# Altium project UKU202045.PRJPCB
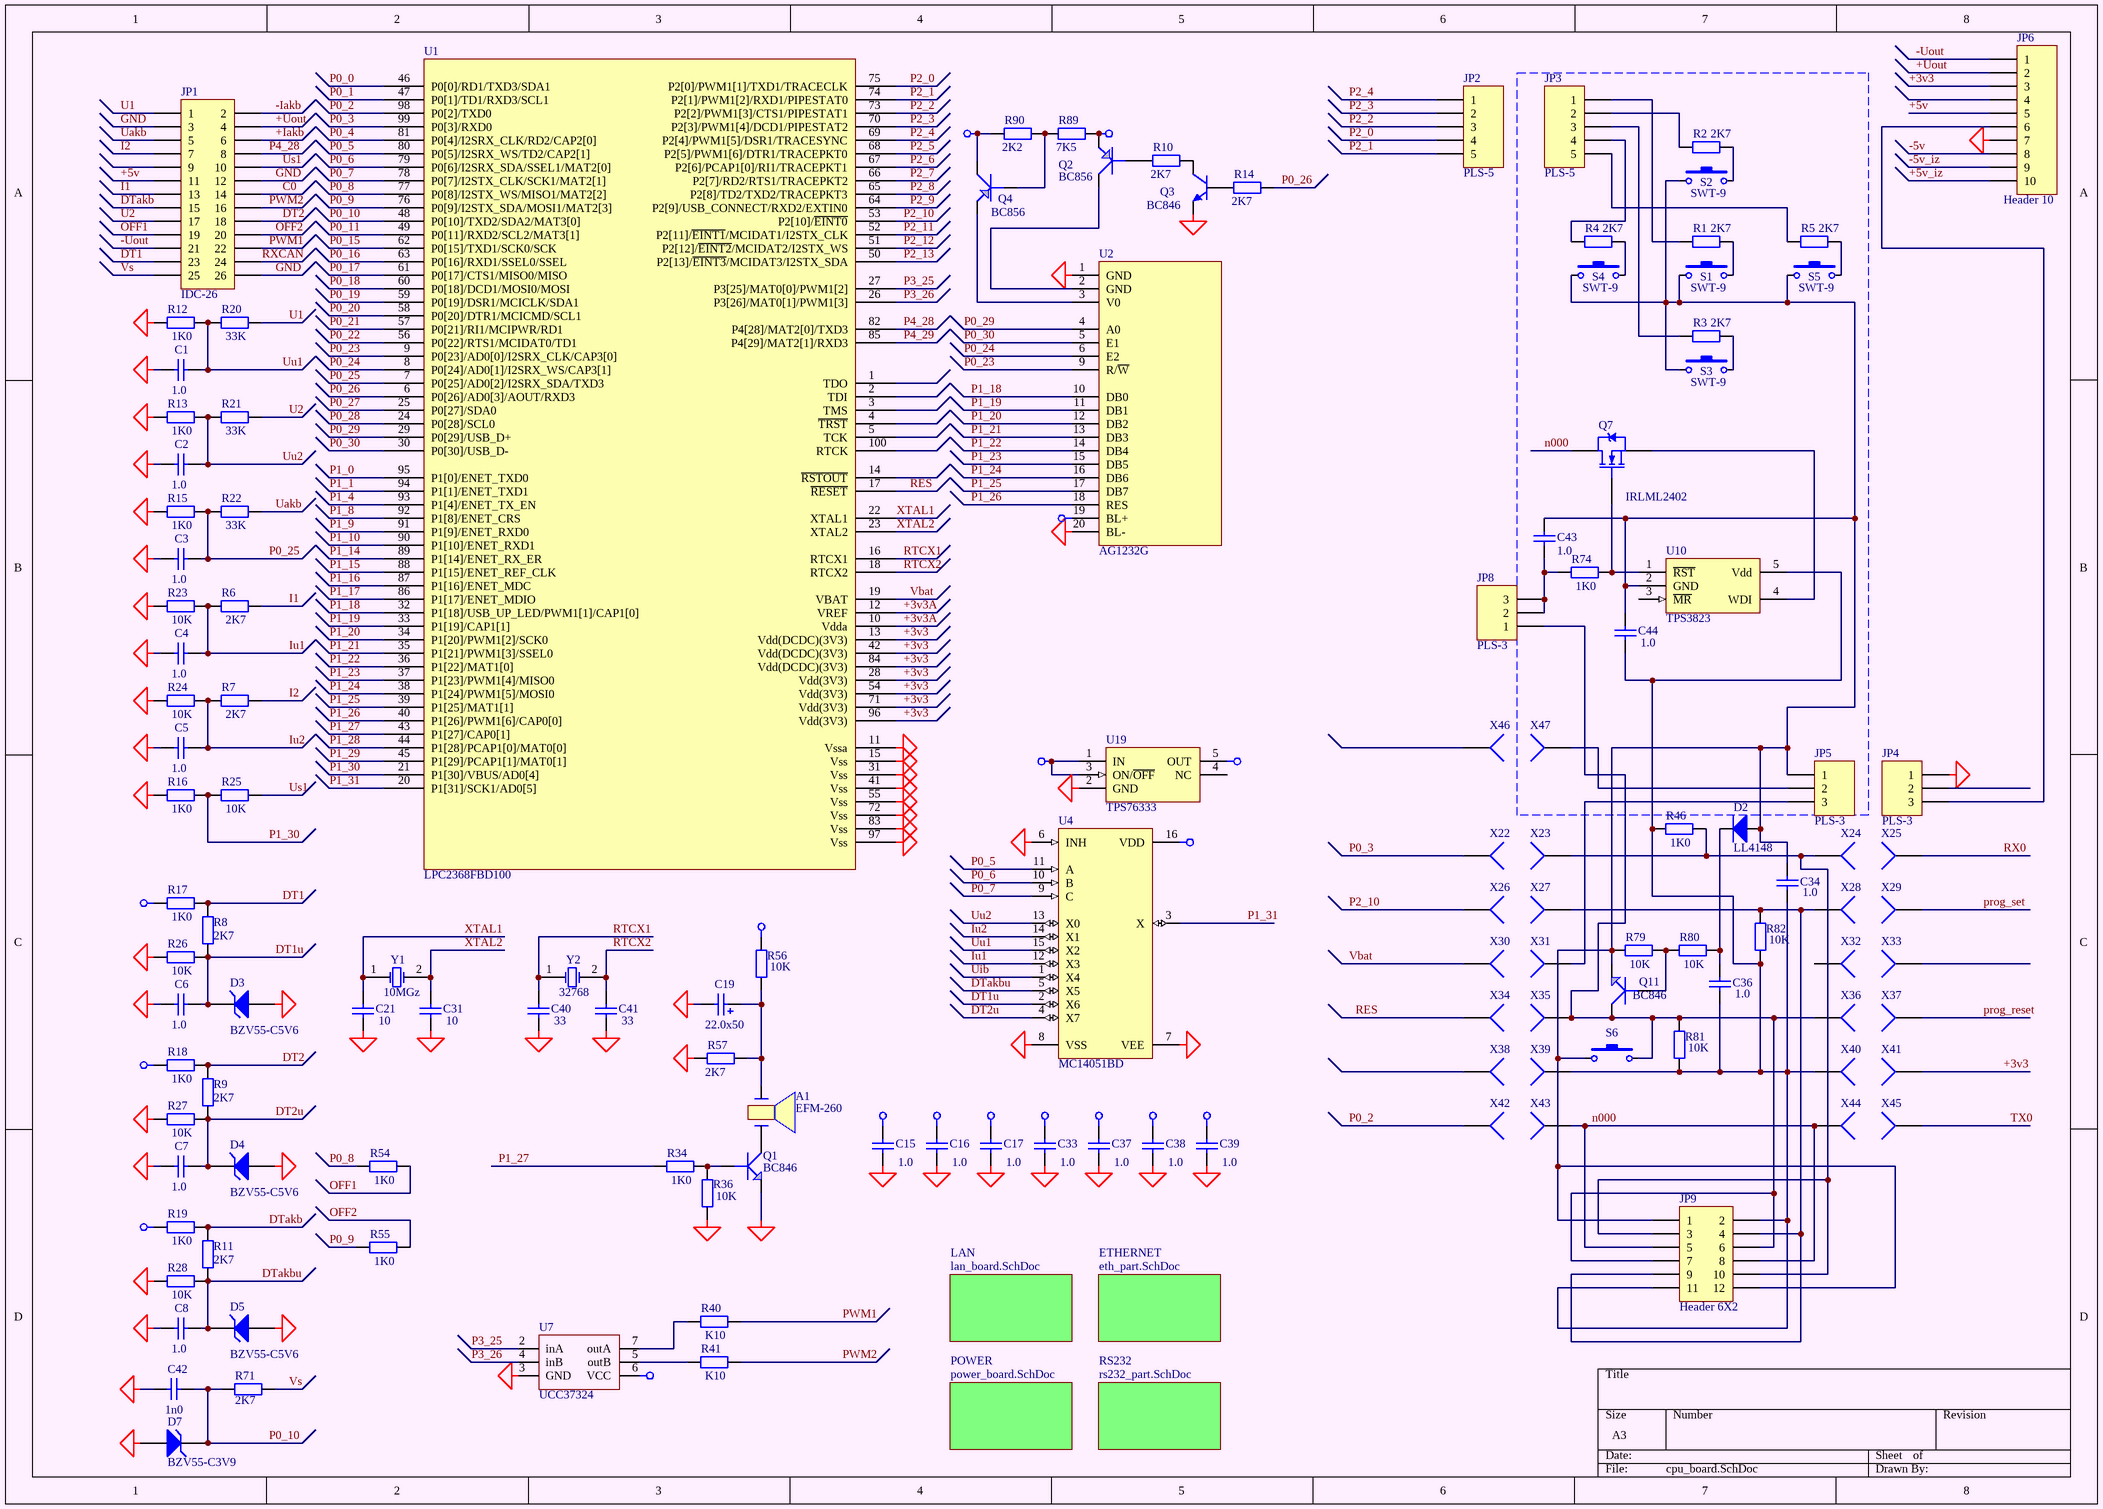
[diagram p0: cpu_board.SchDoc]
5 sheets, 290 parts. Net scope: global (net labels, ports and power ports of the same name join across sheets).
Board file: UKU202045.PcbDoc
Sheets:
  cpu_board.SchDoc
    POWER = power_board.SchDoc
    RS232 = rs232_part.SchDoc
    LAN = lan_board.SchDoc
    ETHERNET = eth_part.SchDoc

## Sheet cpu_board.SchDoc
size A3

### Parts
A1  EFM-260  [Pjezo15]
C1  1.0  [C3216-1206]
C2  1.0  [C3216-1206]
C3  1.0  [C3216-1206]
C4  1.0  [C3216-1206]
C5  1.0  [C3216-1206]
C6  1.0  [C3216-1206]
C7  1.0  [C3216-1206]
C8  1.0  [_1206]
C15  1.0  [C3216-1206]
C16  1.0  [C3216-1206]
C17  1.0  [_1206]
C19  22.0x50  [el3]
C21  10  [_1206]
C31  10  [_1206]
C33  1.0  [_1206]
C34  1.0  [C3216-1206]
C36  1.0  [C3216-1206]
C37  1.0  [_1206]
C38  1.0  [_1206]
C39  1.0  [_1206]
C40  33  [_1206]
C41  33  [_1206]
C42  1n0  [_1206]
C43  1.0  [_1206]
C44  1.0  [_1206]
D2  LL4148  [_1206d]
D3  BZV55-C5V6  [_1206d]
D4  BZV55-C5V6  [_1206d]
D5  BZV55-C5V6  [_1206d]
D7  BZV55-C3V9  [_1206d]
JP1  IDC-26  [SCM-26]
JP2  PLS-5  [HDR1X5]
JP3  PLS-5  [HDR1X5]
JP4  PLS-3  [HDR1X3]
JP5  PLS-3  [HDR1X3]
JP6  Header 10  [HDR2X5]
JP8  PLS-3  [HDR1X3]
JP9  Header 6X2  [sl-12mini]
Q1  BC846  [SO-G3]
Q2  BC856  [SO-G3]
Q3  BC846  [SO-G3]
Q4  BC856  [SO-G3]
Q7  IRLML2402  [SO-G3]
Q11  BC846  [SO-G3]
R1  2K7  [_1206]
R2  2K7  [_1206]
R3  2K7  [_1206]
R4  2K7  [_1206]
R5  2K7  [_1206]
R6  2K7  [_1206]
R7  2K7  [_1206]
R8  2K7  [_1206]
R9  2K7  [_1206]
R10  2K7  [_1206]
R11  2K7  [_1206]
R12  1K0  [_1206]
R13  1K0  [_1206]
R14  2K7  [_1206]
R15  1K0  [_1206]
R16  1K0  [_1206]
R17  1K0  [_1206]
R18  1K0  [_1206]
R19  1K0  [_1206]
R20  33K  [_1206]
R21  33K  [_1206]
R22  33K  [_1206]
R23  10K  [_1206]
R24  10K  [_1206]
R25  10K  [_1206]
R26  10K  [_1206]
R27  10K  [_1206]
R28  10K  [_1206]
R34  1K0  [_1206]
R36  10K  [_1206]
R40  K10  [_1206]
R41  K10  [_1206]
R46  1K0  [_1206]
R54  1K0  [_1206]
R55  1K0  [_1206]
R56  10K  [_1206]
R57  2K7  [_1206]
R71  2K7  [_1206]
R74  1K0  [_1206]
R79  10K  [_1206]
R80  10K  [_1206]
R81  10K  [_1206]
R82  10K  [_1206]
R89  7K5  [_1206]
R90  2K2  [_1206]
S1  SWT-9  [SWT-9]
S2  SWT-9  [SWT-9]
S3  SWT-9  [SWT-9]
S4  SWT-9  [SWT-9]
S5  SWT-9  [SWT-9]
S6  SWT-6  [SWT-6]  (value not drawn)
U1  LPC2368FBD100  [LPC2368]
U2  AG1232G  [AG1232G]
U4  MC14051BD  [SO-G16/C5.85]
U7  UCC37324  [SO-G8]
U10  TPS3823  [SO-G5/P.95]
U19  TPS76333  [SO-G5/P.95]
X22  (no value)  [PIN1]
X23  (no value)  [PIN1]
X24  (no value)  [PIN1]
X25  (no value)  [PIN1]
X26  (no value)  [PIN1]
X27  (no value)  [PIN1]
X28  (no value)  [PIN1]
X29  (no value)  [PIN1]
X30  (no value)  [PIN1]
X31  (no value)  [PIN1]
X32  (no value)  [PIN1]
X33  (no value)  [PIN1]
X34  (no value)  [PIN1]
X35  (no value)  [PIN1]
X36  (no value)  [PIN1]
X37  (no value)  [PIN1]
X38  (no value)  [PIN1]
X39  (no value)  [PIN1]
X40  (no value)  [PIN1]
X41  (no value)  [PIN1]
X42  (no value)  [PIN1]
X43  (no value)  [PIN1]
X44  (no value)  [PIN1]
X45  (no value)  [PIN1]
X46  (no value)  [PIN1]
X47  (no value)  [PIN1]
Y1  10MGz  [QWARZ1]
Y2  32768  [QWARZ2]

### Sub-sheets
ETHERNET = eth_part.SchDoc: no entries
LAN = lan_board.SchDoc: no entries
POWER = power_board.SchDoc: no entries
RS232 = rs232_part.SchDoc: no entries

### Nets
+3v3: C37.2 C38.2 C39.2 JP6.3 U1.13(Vdd(DCDC)(3V3)) U1.28(Vdd(3V3)) U1.42(Vdd(DCDC)(3V3)) U1.54(Vdd(3V3)) U1.71(Vdd(3V3)) U1.84(Vdd(DCDC)(3V3)) U1.96(Vdd(3V3)) U4.16(VDD) X41.1
+3v3A: C17.2 C33.2 U1.10(Vdda) U1.12(VREF) U19.5(OUT)
+5v: C15.2 JP1.11 JP6.5 Q2.2(E) R17.2 R18.2 R19.2 R89.2 U2.19(BL+) U7.6(VCC) U19.1(IN) U19.3(ON/~{OFF})
+5v_iz: JP6.10
+Uout: JP1.4 JP6.2 R56.2
-5v: C16.2 JP6.8 Q4.3(C) R90.1
-5v_iz: JP6.9
GND: C1.2 C2.2 C3.2 C4.2 C5.2 C6.2 C7.2 C8.2 C15.1 C16.1 C17.1 C19.2 C21.1 C31.1 C33.1 C37.1 C38.1 C39.1 C40.1 C41.1 C42.2 D3.1(A) D4.1(A) D5.1(A) D7.1(A) JP1.3 JP1.12 JP1.26 JP4.1 JP6.7 Q1.2(E) Q3.2(E) R12.2 R13.2 R15.2 R16.2 R23.1 R24.1 R26.1 R27.1 R28.1 R36.1 R57.1 U1.11(Vssa) U1.15(Vss) U1.31(Vss) U1.41(Vss) U1.55(Vss) U1.72(Vss) U1.83(Vss) U1.97(Vss) U2.1(GND) U2.20(BL-) U4.6(INH) U4.7(VEE) U4.8(VSS) U7.3(GND) U19.2(GND)
+Iakb: JP1.6
-Iakb: JP1.2
-Uout: JP1.21 JP6.1
C0: JP1.14
DT1: JP1.23 R8.2 R17.1
DT1u: C6.1 D3.2(K) R8.1 R26.2 U4.2(X6)
DT2: JP1.18 R9.2 R18.1
DT2u: C7.1 D4.2(K) R9.1 R27.2 U4.4(X7)
DTakb: JP1.15 R11.2 R19.1
DTakbu: C8.1 D5.2(K) R11.1 R28.2 U4.5(X5)
I1: JP1.13 R6.2
I2: JP1.7 R7.2
Iu1: C4.1 R6.1 R23.2 U4.12(X3)
Iu2: C5.1 R7.1 R24.2 U4.14(X1)
n000: JP9.5 JP9.8 Q7.3(D) X43.1 X44.1
OFF1: JP1.19 R54.2
OFF2: JP1.20 R55.2
P0_0: U1.46(P0[0]/RD1/TXD3/SDA1)
P0_1: U1.47(P0[1]/TD1/RXD3/SCL1)
P0_2: U1.98(P0[2]/TXD0) X42.1
P0_3: U1.99(P0[3]/RXD0) X22.1
P0_4: U1.81(P0[4]/I2SRX_CLK/RD2/CAP2[0])
P0_5: U1.80(P0[5]/I2SRX_WS/TD2/CAP2[1]) U4.11(A)
P0_6: U1.79(P0[6]/I2SRX_SDA/SSEL1/MAT2[0]) U4.10(B)
P0_7: U1.78(P0[7]/I2STX_CLK/SCK1/MAT2[1]) U4.9(C)
P0_8: R54.1 U1.77(P0[8]/I2STX_WS/MISO1/MAT2[2])
P0_9: R55.1 U1.76(P0[9]/I2STX_SDA/MOSI1/MAT2[3])
P0_10: C42.1 D7.2(K) R71.2 U1.48(P0[10]/TXD2/SDA2/MAT3[0])
P0_11: U1.49(P0[11]/RXD2/SCL2/MAT3[1])
P0_15: U1.62(P0[15]/TXD1/SCK0/SCK)
P0_16: U1.63(P0[16]/RXD1/SSEL0/SSEL)
P0_17: U1.61(P0[17]/CTS1/MISO0/MISO)
P0_18: U1.60(P0[18]/DCD1/MOSI0/MOSI)
P0_19: U1.59(P0[19]/DSR1/MCICLK/SDA1)
P0_20: U1.58(P0[20]/DTR1/MCICMD/SCL1)
P0_21: U1.57(P0[21]/RI1/MCIPWR/RD1)
P0_22: U1.56(P0[22]/RTS1/MCIDAT0/TD1)
P0_23: U1.9(P0[23]/AD0[0]/I2SRX_CLK/CAP3[0]) U2.9(R/~{W})
P0_24: U1.8(P0[24]/AD0[1]/I2SRX_WS/CAP3[1]) U2.6(E2)
P0_25: C3.1 R15.1 R22.1 U1.7(P0[25]/AD0[2]/I2SRX_SDA/TXD3)
P0_26: R14.1 U1.6(P0[26]/AD0[3]/AOUT/RXD3)
P0_27: U1.25(P0[27]/SDA0)
P0_28: U1.24(P0[28]/SCL0)
P0_29: U1.29(P0[29]/USB_D+) U2.4(A0)
P0_30: U1.30(P0[30]/USB_D-) U2.5(E1)
P1_0: U1.95(P1[0]/ENET_TXD0)
P1_1: U1.94(P1[1]/ENET_TXD1)
P1_4: U1.93(P1[4]/ENET_TX_EN)
P1_8: U1.92(P1[8]/ENET_CRS)
P1_9: U1.91(P1[9]/ENET_RXD0)
P1_10: U1.90(P1[10]/ENET_RXD1)
P1_14: U1.89(P1[14]/ENET_RX_ER)
P1_15: U1.88(P1[15]/ENET_REF_CLK)
P1_16: U1.87(P1[16]/ENET_MDC)
P1_17: U1.86(P1[17]/ENET_MDIO)
P1_18: U1.32(P1[18]/USB_UP_LED/PWM1[1]/CAP1[0]) U2.10(DB0)
P1_19: U1.33(P1[19]/CAP1[1]) U2.11(DB1)
P1_20: U1.34(P1[20]/PWM1[2]/SCK0) U2.12(DB2)
P1_21: U1.35(P1[21]/PWM1[3]/SSEL0) U2.13(DB3)
P1_22: U1.36(P1[22]/MAT1[0]) U2.14(DB4)
P1_23: U1.37(P1[23]/PWM1[4]/MISO0) U2.15(DB5)
P1_24: U1.38(P1[24]/PWM1[5]/MOSI0) U2.16(DB6)
P1_25: U1.39(P1[25]/MAT1[1]) U2.17(DB7)
P1_26: U1.40(P1[26]/PWM1[6]/CAP0[0]) U2.18(RES)
P1_27: R34.1 U1.43(P1[27]/CAP0[1])
P1_28: U1.44(P1[28]/PCAP1[0]/MAT0[0])
P1_29: U1.45(P1[29]/PCAP1[1]/MAT0[1])
P1_30: R16.1 R25.1 U1.21(P1[30]/VBUS/AD0[4])
P1_31: U1.20(P1[31]/SCK1/AD0[5]) U4.3(X)
P2_0: JP2.4 U1.75(P2[0]/PWM1[1]/TXD1/TRACECLK)
P2_1: JP2.5 U1.74(P2[1]/PWM1[2]/RXD1/PIPESTAT0)
P2_2: JP2.3 U1.73(P2[2]/PWM1[3]/CTS1/PIPESTAT1)
P2_3: JP2.2 U1.70(P2[3]/PWM1[4]/DCD1/PIPESTAT2)
P2_4: JP2.1 U1.69(P2[4]/PWM1[5]/DSR1/TRACESYNC)
P2_5: U1.68(P2[5]/PWM1[6]/DTR1/TRACEPKT0)
P2_6: U1.67(P2[6]/PCAP1[0]/RI1/TRACEPKT1)
P2_7: U1.66(P2[7]/RD2/RTS1/TRACEPKT2)
P2_8: U1.65(P2[8]/TD2/TXD2/TRACEPKT3)
P2_9: U1.64(P2[9]/USB_CONNECT/RXD2/EXTIN0)
P2_10: U1.53(P2[10]/~{EINT0}) X26.1
P2_11: U1.52(P2[11]/~{EINT1}/MCIDAT1/I2STX_CLK)
P2_12: U1.51(P2[12]/~{EINT2}/MCIDAT2/I2STX_WS)
P2_13: U1.50(P2[13]/~{EINT3}/MCIDAT3/I2STX_SDA)
P3_25: U1.27(P3[25]/MAT0[0]/PWM1[2]) U7.2(inA)
P3_26: U1.26(P3[26]/MAT0[1]/PWM1[3]) U7.4(inB)
P4_28: JP1.8 U1.82(P4[28]/MAT2[0]/TXD3)
P4_29: U1.85(P4[29]/MAT2[1]/RXD3)
prog_reset: X37.1
prog_set: X29.1
PWM1: JP1.22 R40.1
PWM2: JP1.16 R41.1
RES: U1.17(~{RESET}) X34.1
RTCX1: C40.2 U1.16(RTCX1) Y2.1(OSC1)
RTCX2: C41.2 U1.18(RTCX2) Y2.2(OSC2)
RX0: X25.1
RXCAN: JP1.24
TX0: X45.1
U1: JP1.1 R20.2
U2: JP1.17 R21.2
Uakb: JP1.5 R22.2
Uib: U4.1(X4)
Us1: JP1.10 R25.2
Uu1: C1.1 R12.1 R20.1 U4.15(X2)
Uu2: C2.1 R13.1 R21.1 U4.13(X0)
Vbat: U1.19(VBAT) X30.1
Vs: JP1.25 R71.1
XTAL1: C21.2 U1.22(XTAL1) Y1.1(OSC1)
XTAL2: C31.2 U1.23(XTAL2) Y1.2(OSC2)
NetA1_1: A1.1 Q1.3(C)
NetA1_2: A1.2 C19.1 R56.1 R57.2
NetC34_1: C34.1 C43.1 C44.2 D2.1(A) JP5.1 JP9.1 JP9.12 Q11.2(E) R79.1 S1.1 S2.1 S3.1 S4.1 S5.1 S6.1 U10.2(GND)
NetC34_2: C34.2 C36.2 C44.1 JP9.2 JP9.11 R46.2 R81.1 R82.1 U10.5(Vdd) X39.1 X40.1
NetC36_1: C36.1 D2.2(K) R80.2
NetC43_2: C43.2 JP8.2 JP8.3 R74.2
NetJP3_1: JP3.1 R1.2
NetJP3_2: JP3.2 R2.2
NetJP3_3: JP3.3 R3.2
NetJP3_4: JP3.4 R4.2
NetJP3_5: JP3.5 R5.2
NetJP4_3: JP4.3 JP6.6
NetJP5_2: JP5.2 X47.1
NetJP5_3: JP5.3 X31.1
NetJP8_1: JP8.1 JP9.6 JP9.7 Q11.3(C) R81.2 S6.2 X35.1 X36.1
NetJP9_3: JP9.3 JP9.10 R46.1 X23.1 X24.1
NetJP9_4: JP9.4 JP9.9 R82.2 X27.1 X28.1
NetQ1_1: Q1.1(B) R34.2 R36.2
NetQ2_1: Q2.1(B) R10.2
NetQ2_3: Q2.3(C) U2.2(GND)
NetQ3_1: Q3.1(B) R14.2
NetQ3_3: Q3.3(C) R10.1
NetQ4_1: Q4.1(B) R89.1 R90.2
NetQ4_2: Q4.2(E) U2.3(V0)
NetQ7_1: Q7.1(G) R74.1 U10.1(~{RST})
NetQ7_2: Q7.2(S) U10.4(WDI)
NetQ11_1: Q11.1(B) R79.2 R80.1
NetR1_1: R1.1 S1.2
NetR2_1: R2.1 S2.2
NetR3_1: R3.1 S3.2
NetR4_1: R4.1 S4.2
NetR5_1: R5.1 S5.2
NetR40_2: R40.2 U7.7(outA)
NetR41_2: R41.2 U7.5(outB)

Not connected (* = marked no-connect by the designer): JP1 9; JP4 2; JP6 4; U1 1(TDO) 2(TDI) 3(TMS) 4(~{TRST}) 5(TCK) 14(~{RSTOUT}) 100(RTCK); U10 3(~{MR}); U19 4(NC); X32 1; X33 1; X38 1; X46 1

### Library data of the parts
A1 = PJEZ0
C1-C8 C34 C36 C42 = Cap Semi: Capacitor (Semiconductor SIM Model); Manufacturer: Generic Components; Class I: Passive; Value: 1,0; Published: 8-Jun-2000; Revision: July-2002: Re-released for DXP Platform.; Publisher: Altium Limited; Class II: Capacitor
C15-C17 C33 C37-C39 = Cap Semi: Capacitor (Semiconductor SIM Model); Manufacturer: Generic Components; Class I: Passive; Value: 0,1; Published: 8-Jun-2000; Revision: July-2002: Re-released for DXP Platform.; Publisher: Altium Limited; Class II: Capacitor
C19 = Cap Pol1: Polarized Capacitor (Radial); Manufacturer: Generic Components; Class I: Passive; Value: 22,0; Published: 8-Jun-2000; Revision: July-2002: Re-released for DXP Platform.; Publisher: Altium Limited; Class II: Capacitor
C21 C31 C40 C41 = Cap Semi: Capacitor (Semiconductor SIM Model); Manufacturer: Generic Components; Class I: Passive; Value: 15pF; Published: 8-Jun-2000; Revision: July-2002: Re-released for DXP Platform.; Publisher: Altium Limited; Class II: Capacitor
C43 C44 = Cap Semi: Capacitor; Manufacturer: Generic Components; Class I: Passive; Value: 0,1; Published: 8-Jun-2000; Revision: July-2002: Re-released for DXP Platform.; Publisher: Altium Limited; Class II: Capacitor
D2 = Diode: Default Diode; Manufacturer: Generic Components; Class I: Discrete; Class II: Diode - Switching; Published: 8-Jun-2000; Revision: July-2002: Re-released for DXP Platform.; Publisher: Altium Limited
D3-D5 D7 = D Zener: Zener Diode; Manufacturer: Generic Components; Class I: Discrete; Class II: Diode - Zener; Published: 8-Jun-2000; Revision: July-2002: Re-released for DXP Platform.; Publisher: Altium Limited
JP1 = MHDR2X13: Header, 13-Pin, Dual row; Manufacturer: Generic Components; Class I: Connector; Revision: July-2002: Re-released for DXP Platform.; Publisher: Altium Limited
JP2 JP3 = Header 5: Header, 5-Pin; Manufacturer: Generic Components; Class I: Connector; Revision: July-2002: Re-released for DXP Platform.; Publisher: Altium Limited
JP4 JP5 JP8 = Header 3: Header, 3-Pin; Manufacturer: Generic Components; Class I: Connector; Revision: July-2002: Re-released for DXP Platform.; Publisher: Altium Limited
JP6 = Header 10: Header, 10-Pin; Manufacturer: Generic Components; Class I: Connector; Revision: July-2002: Re-released for DXP Platform.; Publisher: Altium Limited
JP9 = Header 6X2: Header, 6-Pin, Dual row; Manufacturer: Generic Components; Class I: Connector; Revision: July-2002: Re-released for DXP Platform.; Publisher: Altium Limited
Q1 Q11 = GT122: Right: 20; Bottom: 20
Q2 Q4 = GT109: Right: 20; Bottom: 20
Q3 = BC847ALT1: General Purpose Transistor NPN Silicon; Manufacturer: Motorola; Package Information: Latest Revision: 1997; Class I: Discrete; Class II: BJT - Low Power; Published: 29-Sep-2000; Revision: July-2002: Re-released for DXP Platform.; Datasheet: Latest Revision: 1997; Package Reference: 318-08; Publisher: Altium Limited
Q7 = IRLML2402: HEXFET Power MOSFET; Manufacturer: International Rectifier; Class I: Discrete; Class II: MOSFET - Power; Published: 8-Jun-2000; Revision: July-2002: Re-released for DXP Platform.; Datasheet: Latest Revision: Aug-1997; Package Reference: SOT-23; Publisher: Altium Limited; Value: IRLML2402
R1-R9 R11 R20-R28 R34 R40 R41 R46 R54-R57 R71 R74 R79-R82 R89 R90 = Res2: Resistor; Manufacturer: Generic Components; Class I: Passive; Rule: Undefined; Published: 8-Jun-2000; Revision: July-2002: Re-released for DXP Platform.; Publisher: Altium Limited; Class II: Resistor
  R1-R9 R11 R57 R71: Value: 2K7
  R20-R22: Value: 33K
  R23-R28 R56 R79-R82: Value: 10K
  R34 R46 R54 R55 R74: Value: 1K0
  R40 R41: Value: K10
  R89: Value: 7K5
  R90: Value: 2K2
R10 R14 = Res2: Resistor; Manufacturer: Generic Components; Class I: Passive; Value: 1K0; Rule: Undefined; Published: 8-Jun-2000; Revision: July-2002: Re-released for DXP Platform.; Publisher: Altium Limited; Class II: Resistor
R12 R13 R15-R19 = Res2: Resistor; Manufacturer: Generic Components; Class I: Passive; Value: 1K; Rule: Undefined; Published: 8-Jun-2000; Revision: July-2002: Re-released for DXP Platform.; Publisher: Altium Limited; Class II: Resistor
R36 = Res2: Resistor; Manufacturer: Generic Components; Class I: Passive; Published: 8-Jun-2000; Revision: July-2002: Re-released for DXP Platform.; Publisher: Altium Limited; Class II: Resistor; Value: 10K
S1-S5 = SWT-9: Switch; Manufacturer: Generic Components; Published: 24-Mar-1999; Revision: July-2002: Re-released for DXP Platform.; Publisher: Altium Limited
S6 = SWT-9: Button; Manufacturer: Generic Components; Published: 24-Mar-1999; Revision: July-2002: Re-released for DXP Platform.; Publisher: Altium Limited; Value: SWT-6
U4 = MC14051BD: 8-Channel Analog Multiplexer/Demultiplexer; Manufacturer: ON Semiconductor; Class I: Logic; Class II: Multiplexer/Encoder/Selector; Published: 15-Apr-2002; Package Reference: 751B-05; Publisher: Altium Limited
U10 = TPS3823: Reset IC; Manufacturer: National Semiconductor; Package Information: Latest Revision: Aug-1999; Class I: Power Management; Class II: Voltage Regulator; Value: TPS76333; Published: 15-Apr-2002; Datasheet: Latest Revision: Oct-1999; Package Reference: MA05B; Publisher: Altium Limited
U19 = LP2980AIM5-3.3: Micropower SOT, 50 mA Ultra Low-Dropout Regulator; Manufacturer: National Semiconductor; Package Information: Latest Revision: Aug-1999; Class I: Power Management; Class II: Voltage Regulator; Published: 15-Apr-2002; Datasheet: Latest Revision: Oct-1999; Package Reference: MA05B; Publisher: Altium Limited
X22-X47 = Socket: Manufacturer: Generic Components; Class I: Connector; Revision: July-2002: Re-released for DXP Platform.; Publisher: Altium Limited
Y1 Y2 = XTAL: Crystal Oscillator; Manufacturer: Generic Components; Published: 8-Jun-2000; Revision: July-2002: Re-released for DXP Platform.; Publisher: Altium Limited; Class I: Oscillator; Class II: Crystal Oscillator

## Sheet power_board.SchDoc
size A3
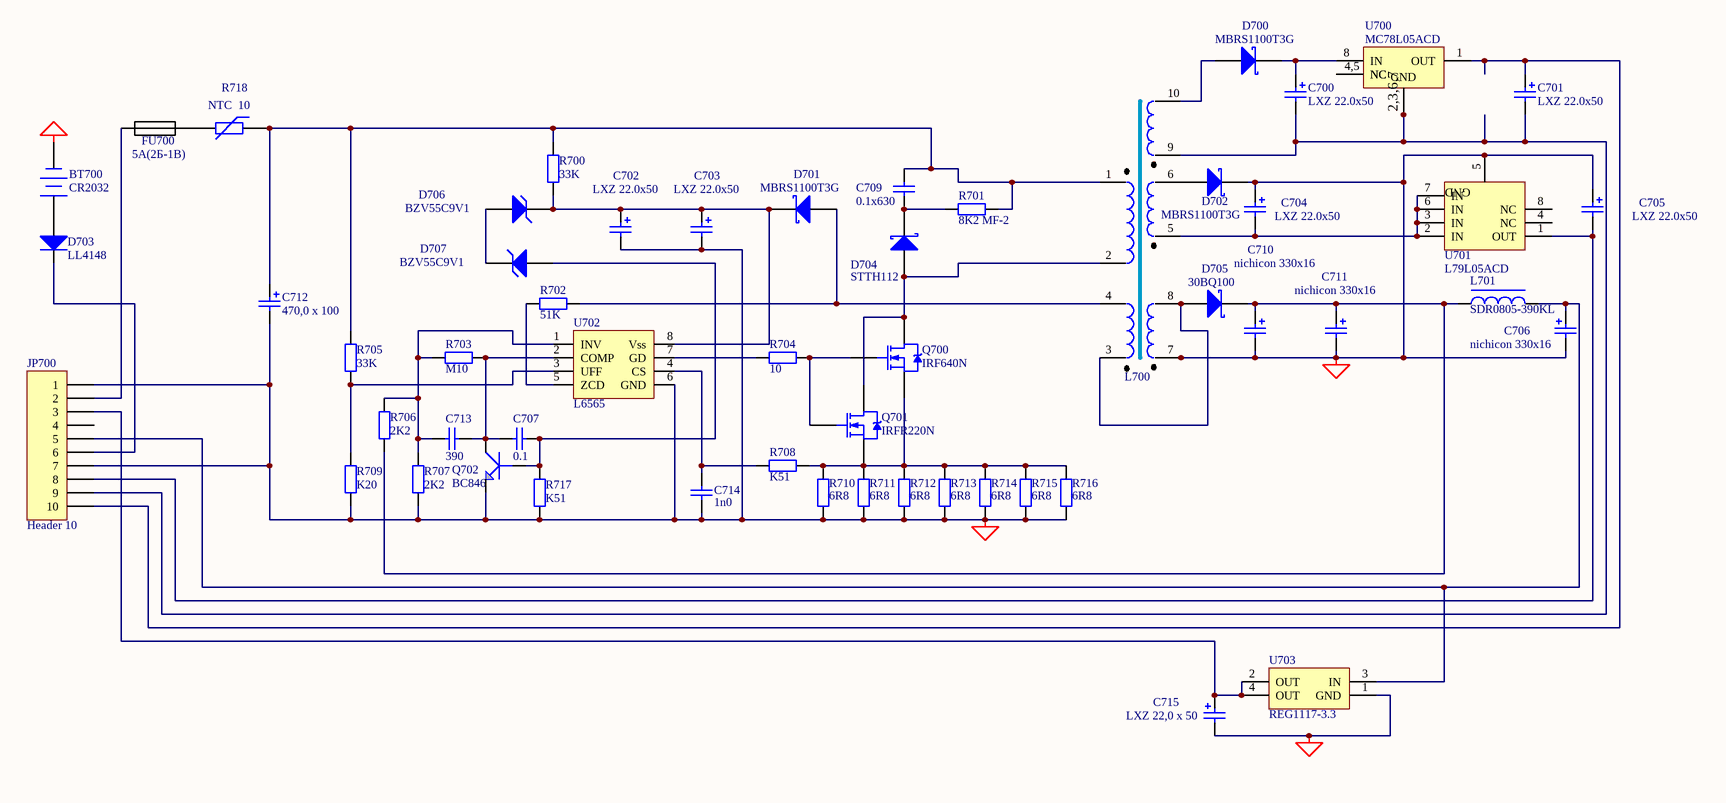
[diagram p1: power_board.SchDoc]

### Parts
BT700  CR2032  [BAT_SUPP]
C700  LXZ 22.0x50  [el3]
C701  LXZ 22.0x50  [el3]
C702  LXZ 22.0x50  [el3]
C703  LXZ 22.0x50  [el3]
C704  LXZ 22.0x50  [el3]
C705  LXZ 22.0x50  [el3]
C706  nichicon 330x16  [el5]
C707  0.1  [_1206]
C709  0.1x630  [c15]
C710  nichicon 330x16  [el5]
C711  nichicon 330x16  [el5]
C712  470,0 x 100  [el_15_25_h]
C713  390  [_1206]
C714  1n0  [_1206]
C715  LXZ 22,0 x 50  [el3]
D700  MBRS1100T3G  [D_6_3]
D701  MBRS1100T3G  [D_6_3]
D702  MBRS1100T3G  [D_6_3]
D703  LL4148  [_1206d]
D704  STTH112  [D_6_3]
D705  30BQ100  [30BQ100]
D706  BZV55C9V1  [_1206d]
D707  BZV55C9V1  [_1206d]
FU700  5A(2Б-1В)  [FUSE2]
JP700  Header 10  [HDR2X5]
L700  L220-K10  [trans_ring1]  (value not drawn)
L701  SDR0805-390KL  [L10x10]
Q700  IRF640N  [TO220_h]
Q701  IRFR220N  [SIP-G3/E13]
Q702  BC846  [SO-G3]
R700  33K  [_1206]
R701  8K2 MF-2  [AXIAL-0.7]
R702  51K  [_1206]
R703  M10  [_1206]
R704  10  [_1206]
R705  33K  [_1206]
R706  2K2  [_1206]
R707  2K2  [_1206]
R708  K51  [_1206]
R709  K20  [_1206]
R710  6R8  [_1206]
R711  6R8  [_1206]
R712  6R8  [_1206]
R713  6R8  [_1206]
R714  6R8  [_1206]
R715  6R8  [_1206]
R716  6R8  [_1206]
R717  K51  [_1206]
R718  NTC  10  [JVR07N]
U700  MC78L05ACD  [SO-G8]
U701  L79L05ACD  [SO-G8]
U702  L6565  [so-g8]
U703  REG1117-3.3  [DSO-G3]

### Nets
GND_p: BT700.2(-) C702.2 C703.2 C704.1 C705.1 C706.2 C710.2 C711.2 C712.2 C714.2 C715.2 D702.2(K) JP700.1 JP700.7 L700.7 Q702.2(E) R707.1 R709.1 R710.2 R711.2 R712.2 R713.2 R714.2 R715.2 R716.2 R717.1 U701.5(GND) U702.6(GND) U703.1(GND)
NetBT700_1: BT700.1(+) D703.1(A)
NetC700_1: C700.1 D700.2(K) U700.8(IN)
NetC700_2: C700.2 C701.2 JP700.9 L700.9 U700.2(GND) U700.3(GND) U700.6(GND) U700.7(GND)
NetC701_1: C701.1 JP700.10 U700.1(OUT)
NetC702_1: C702.1 C703.1 D701.2(K) D706.2(K) R700.2 U702.8(Vss)
NetC704_2: C704.2 L700.5 U701.2(IN) U701.3(IN) U701.6(IN) U701.7(IN)
NetC705_2: C705.2 JP700.8 U701.1(OUT)
NetC706_1: C706.1 JP700.5 L701.1 U703.3(IN)
NetC707_1: C707.1 C713.2 Q702.3(C) R703.1 U702.2(COMP)
NetC707_2: C707.2 D707.1(A) Q702.1(B) R717.2
NetC709_1: C709.1 D704.2(K) R701.2
NetC709_2: C709.2 C712.1 L700.1 R700.1 R701.1 R705.2 R718.1
NetC710_1: C710.1 C711.1 D705.2(K) L701.2 R706.1
NetC713_1: C713.1 R703.2 R706.2 R707.2 U702.1(INV)
NetC714_1: C714.1 R708.2 U702.4(CS)
NetC715_1: C715.1 JP700.3 U703.2(OUT) U703.4(OUT)
NetD700_1: D700.1(A) L700.10
NetD701_1: D701.1(A) L700.4 R702.1
NetD702_1: D702.1(A) L700.6
NetD703_2: D703.2(K) JP700.6
NetD704_1: D704.1(A) L700.2 Q700.2(D) Q701.2(D)
NetD705_1: D705.1(A) L700.3 L700.8
NetD706_1: D706.1(A) D707.2(K)
NetFU700_1: FU700.1 JP700.2
NetFU700_2: FU700.2 R718.2
NetQ700_1: Q700.1(G) Q701.1(G) R704.1
NetQ700_3: Q700.3(S) Q701.3(S) R708.1 R710.1 R711.1 R712.1 R713.1 R714.1 R715.1 R716.1
NetR702_2: R702.2 U702.5(ZCD)
NetR704_2: R704.2 U702.7(GD)
NetR705_1: R705.1 R709.2 U702.3(UFF)
NetU700_4: U700.4(NC) U700.5(NC)

Not connected (* = marked no-connect by the designer): JP700 4; U701 4(NC) 8(NC)

### Notes on the sheet
- (in symbol MC78L05ACD) 4,5; 2,3,6,7

### Library data of the parts
BT700 = Battery: Multicell Battery; Manufacturer: Generic Components; Published: 24-Mar-1999; Revision: July-2002: Re-released for DXP Platform.; Publisher: Altium Limited
C700 C701 = Cap Pol1: Polarized Capacitor (Radial); Manufacturer: Generic Components; Class I: Passive; Value: 10,0x25; Published: 8-Jun-2000; Revision: July-2002: Re-released for DXP Platform.; Publisher: Altium Limited; Class II: Capacitor
C702-C706 C710-C712 = Cap Pol1: Polarized Capacitor (Radial); Manufacturer: Generic Components; Class I: Passive; Value: 22,0x50; Published: 8-Jun-2000; Revision: July-2002: Re-released for DXP Platform.; Publisher: Altium Limited; Class II: Capacitor
C707 C709 C713 C714 = Cap Semi: as C1 on sheet cpu_board; Published: 8-Jun-2000; Revision: July-2002: Re-released for DXP Platform.; Publisher: Altium Limited; Class II: Capacitor
C715 = Cap Pol1: Polarized Capacitor (Radial); Manufacturer: Generic Components; Class I: Passive; Published: 8-Jun-2000; Revision: July-2002: Re-released for DXP Platform.; Publisher: Altium Limited; Class II: Capacitor; Value: 22,0x50
D700-D702 D705 = 10BQ015: Schottky Rectifier; Manufacturer: International Rectifier; Revision 1: 10-July-2000: SIM Model Added.; Revision 2: July-2002: Re-released for DXP Platform.; Class I: Discrete; Class II: Rectifier - Schottky; Published: 8-Jun-2000; Datasheet: Latest Revision: PD-2.396A; Package Reference: DO-214AA; Publisher: Altium Limited
D703 = Diode: as D2 on sheet cpu_board; Published: 8-Jun-2000; Revision: July-2002: Re-released for DXP Platform.; Publisher: Altium Limited
D704 = 10BQ015: Schottky Diode; Manufacturer: International Rectifier; Revision 1: 10-July-2000: SIM Model Added.; Revision 2: July-2002: Re-released for DXP Platform.; Class I: Discrete; Class II: Rectifier - Schottky; Value: 10BQ100; Published: 8-Jun-2000; Datasheet: Latest Revision: PD-2.396A; Package Reference: DO-214AA; Publisher: Altium Limited
D706 D707 = D Zener: Zener Diode; Manufacturer: Generic Components; Class I: Discrete; Class II: Diode - Zener; Value: BZV55C3V9; Published: 8-Jun-2000; Revision: July-2002: Re-released for DXP Platform.; Publisher: Altium Limited
FU700 = FUSE
JP700 = Header 10: as JP6 on sheet cpu_board; Revision: July-2002: Re-released for DXP Platform.; Publisher: Altium Limited
L700 = L1_dc_2: Дроссель
L701 = Inductor Konstr 2: Magnetic-Core Inductor; Manufacturer: Generic Components; Class I: Passive; Published: 24-Mar-1999; Revision: July-2002: Re-released for DXP Platform.; Publisher: Altium Limited; Class II: Inductor
Q700 Q701 = NMOS-2: N-Channel Power MOSFET; Manufacturer: Generic Components; Class I: Discrete; Class II: MOSFET - Power; Note: Pin 2 is electrically connected to pin 4.; Published: 8-Jun-2000; Revision: July-2002: Re-released for DXP Platform.; Datasheet: Latest Revision: PD-9.814; Package Reference: TO-220AB; Publisher: Altium Limited
Q702 = GT122: Bipolar transistor; Right: 20; Bottom: 20; Value: BC846
R700-R717 = Res2: as R10 on sheet cpu_board; Published: 8-Jun-2000; Revision: July-2002: Re-released for DXP Platform.; Publisher: Altium Limited; Class II: Resistor
R718 = Res Varistor: Varistor (Voltage-Sensitive Resistor); Manufacturer: Generic Components; Class I: Discrete; Published: 24-Mar-1999; Revision: July-2002: Re-released for DXP Platform.; Publisher: Altium Limited; Class II: Voltage-Sensitive Resistor
U700 = MC78L05ACD: 3-Terminal Low-Current Positive Fixed Voltage Regulator; Manufacturer: Motorola; Class I: Power Management; Published: 15-Apr-2002; Datasheet: Linear and Interface Integrated Circuits, DL128 Rev2 (1988); Package Reference: 751-02; Publisher: Altium Limited; Class II: Voltage Regulator
U701 = L79L05ACD: Negative Voltage Regulator; Manufacturer: ST-Microelectronics; Package Information: Latest Revision: Jul-1998; Class I: Power Management; Published: 24-Aug-2001; Revision: July-2002: Re-released for DXP Platform.; Datasheet: Latest Revision: Apr-1999; Package Reference: SO8; Publisher: Altium Limited; Class II: Voltage Regulator
U703 = REG1117-3.3: 800mA and 1A Low Dropout Positive Regulator 2.85V, 3.3V, 5V, and Adjustable; Manufacturer: Burr-Brown; Package Information: Latest Revision: Rev. C; Class I: Power Management; Class II: Voltage Regulator; Published: 8-Jun-2000; Revision: July-2002: Re-released for DXP Platform.; Datasheet: Latest Revision: Sep-1997; Package Reference: ZZ311; Publisher: Altium Limited

## Sheet rs232_part.SchDoc
size B
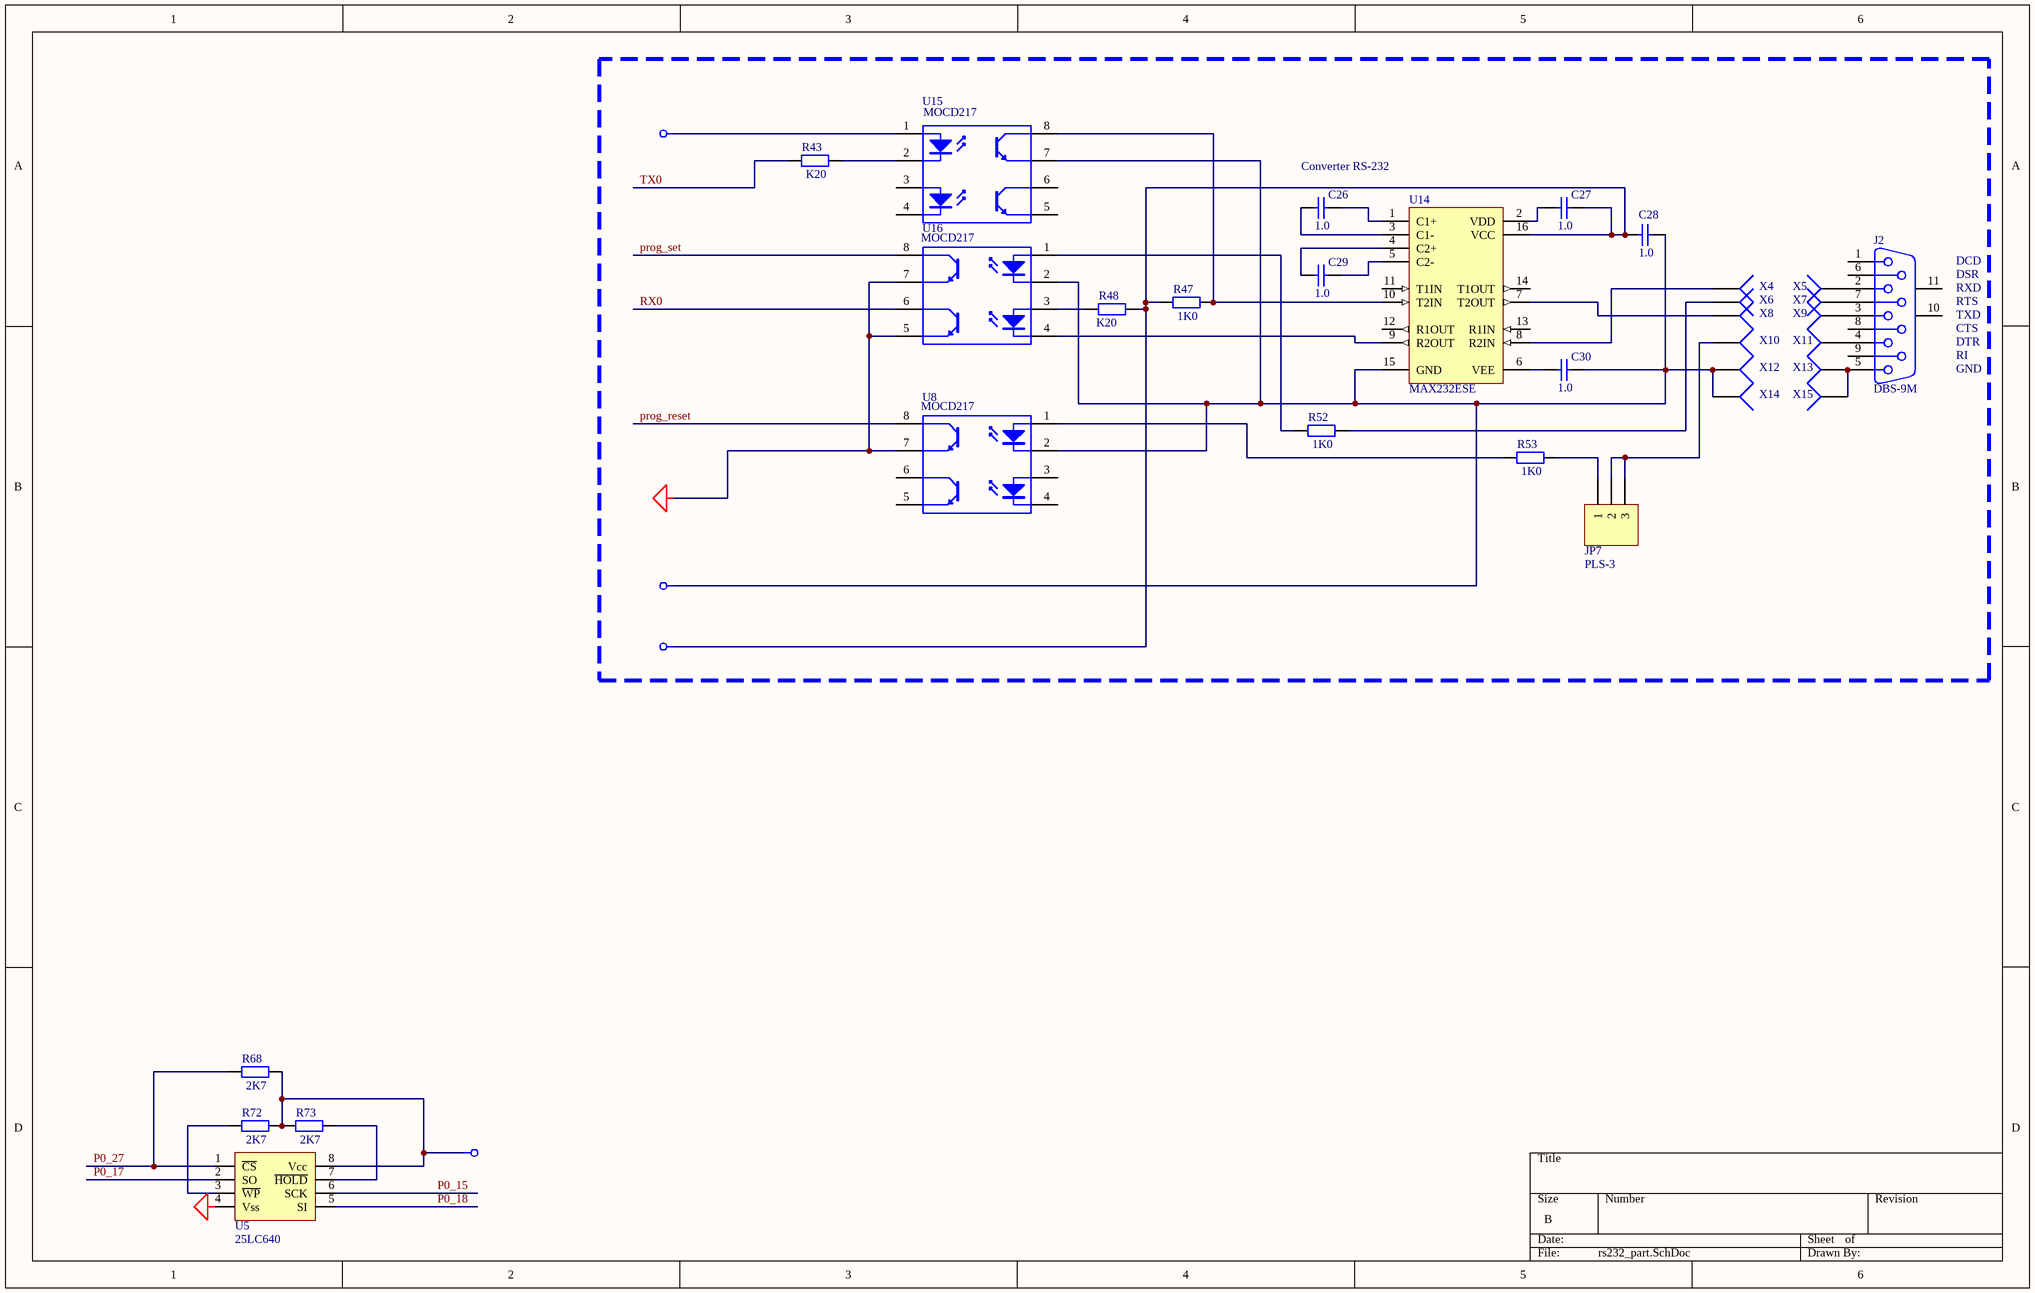
[diagram p2: rs232_part.SchDoc]

### Parts
C26  1.0  [C3216-1206]
C27  1.0  [_1206]
C28  1.0  [C3216-1206]
C29  1.0  [C3216-1206]
C30  1.0  [C3216-1206]
J2  DBS-9M  [DSUB_N9]
JP7  PLS-3  [HDR1X3]
R43  K20  [_1206]
R47  1K0  [_1206]
R48  K20  [_1206]
R52  1K0  [_1206]
R53  1K0  [_1206]
R68  2K7  [_1206]
R72  2K7  [_1206]
R73  2K7  [_1206]
U5  25LC640  [SO-G8/D5]
U8  MOCD217  [SO-G8]
U14  MAX232ESE  [SO-G16]
U15  MOCD217  [SO-G8]
U16  MOCD217  [SO-G8]
X4  (no value)  [PIN1]
X5  (no value)  [PIN1]
X6  (no value)  [PIN1]
X7  (no value)  [PIN1]
X8  (no value)  [PIN1]
X9  (no value)  [PIN1]
X10  (no value)  [PIN1]
X11  (no value)  [PIN1]
X12  (no value)  [PIN1]
X13  (no value)  [PIN1]
X14  (no value)  [PIN1]
X15  (no value)  [PIN1]

### Nets
+3v3: U15.1(A)
+5v: R68.2 R72.2 R73.1 U5.8(Vcc)
+5v_iz: C27.2 C28.1 R47.1 R48.2 U14.16(VCC)
-5v_iz: C28.2 C30.2 U8.2(K) U14.15(GND) U15.7(E) U16.2(K) X12.1 X14.1
GND: U5.4(Vss) U8.7(E) U16.5(E) U16.7(E)
P0_15: U5.6(SCK)
P0_17: U5.2(SO)
P0_18: U5.5(SI)
P0_27: R68.1 U5.1(~{CS})
prog_reset: U8.8(C)
prog_set: U16.8(C)
RX0: U16.6(C)
TX0: R43.1
NetC26_1: C26.1 U14.3(C1-)
NetC26_2: C26.2 U14.1(C1+)
NetC27_1: C27.1 U14.2(VDD)
NetC29_1: C29.1 U14.4(C2+)
NetC29_2: C29.2 U14.5(C2-)
NetC30_1: C30.1 U14.6(VEE)
NetJ2_2: J2.2 X5.1
NetJ2_3: J2.3 X9.1
NetJ2_4: J2.4 X11.1
NetJ2_5: J2.5 X13.1 X15.1
NetJ2_7: J2.7 X7.1
NetJP7_1: JP7.1 R53.2
NetJP7_2: JP7.2 JP7.3 X10.1
NetR43_2: R43.2 U15.2(K)
NetR47_2: R47.2 U14.10(T2IN) U15.8(C)
NetR48_1: R48.1 U16.3(A)
NetR52_1: R52.1 U16.1(A)
NetR52_2: R52.2 X6.1
NetR53_1: R53.1 U8.1(A)
NetR72_1: R72.1 U5.3(~{WP})
NetR73_2: R73.2 U5.7(~{HOLD})
NetU14_7: U14.7(T2OUT) X8.1
NetU14_8: U14.8(R2IN) X4.1
NetU14_9: U14.9(R2OUT) U16.4(K)

Not connected (* = marked no-connect by the designer): J2 1 6 8 9 10(MH1) 11(MH2); U8 3(A) 4(K) 5(E) 6(C); U14 11(T1IN) 12(R1OUT) 13(R1IN) 14(T1OUT); U15 3(A) 4(K) 5(E) 6(C)

### Notes on the sheet
- Converter RS-232
- (near J2) DCD
- (near J2) DSR
- (near J2) RXD
- (near J2) RTS
- (near J2) TXD
- (near J2) CTS
- (near J2) DTR
- (near J2) RI
- (near J2) GND

### Library data of the parts
C26-C30 = Cap Semi: as C1 on sheet cpu_board; Published: 8-Jun-2000; Revision: July-2002: Re-released for DXP Platform.; Publisher: Altium Limited; Class II: Capacitor
J2 = D Connector 9: Receptacle Assembly, 9 Position, Right Angle; Manufacturer: Generic Components; Package Information: Latest Revision: O; Positions: 9; Published: 15-Jun-2001; Revision: July-2002: Re-released for DXP Platform.; Datasheet: (1-Sep-1999); Package Reference: 788750; Publisher: Altium Limited; Class I: Connector; Orientation: Right Angle; Gender: Receptacle
JP7 = Header 3: as JP4 on sheet cpu_board; Revision: July-2002: Re-released for DXP Platform.; Publisher: Altium Limited
R43 R48 = Res2: Resistor; Manufacturer: Generic Components; Class I: Passive; Value: 200R; Rule: Undefined; Published: 8-Jun-2000; Revision: July-2002: Re-released for DXP Platform.; Publisher: Altium Limited; Class II: Resistor
R47 R52 R53 R68 R72 R73 = Res2: as R1 on sheet cpu_board; Published: 8-Jun-2000; Revision: July-2002: Re-released for DXP Platform.; Publisher: Altium Limited; Class II: Resistor
  R47 R52 R53: Value: 1K0
  R68 R72 R73: Value: 2K7
U14 = MAX232ESE: +5V Powered, Multi-Channel RS-232 Driver/Receiver; Manufacturer: Maxim; Class I: Communication; Class II: Transceiver; Published: 16-Jan-2001; Revision: July-2002: Re-released for DXP Platform.; Package Reference: NSO16; Publisher: Altium Limited
X4-X15 = Socket: as X22 on sheet cpu_board; Revision: July-2002: Re-released for DXP Platform.; Publisher: Altium Limited

## Sheet lan_board.SchDoc
size A4
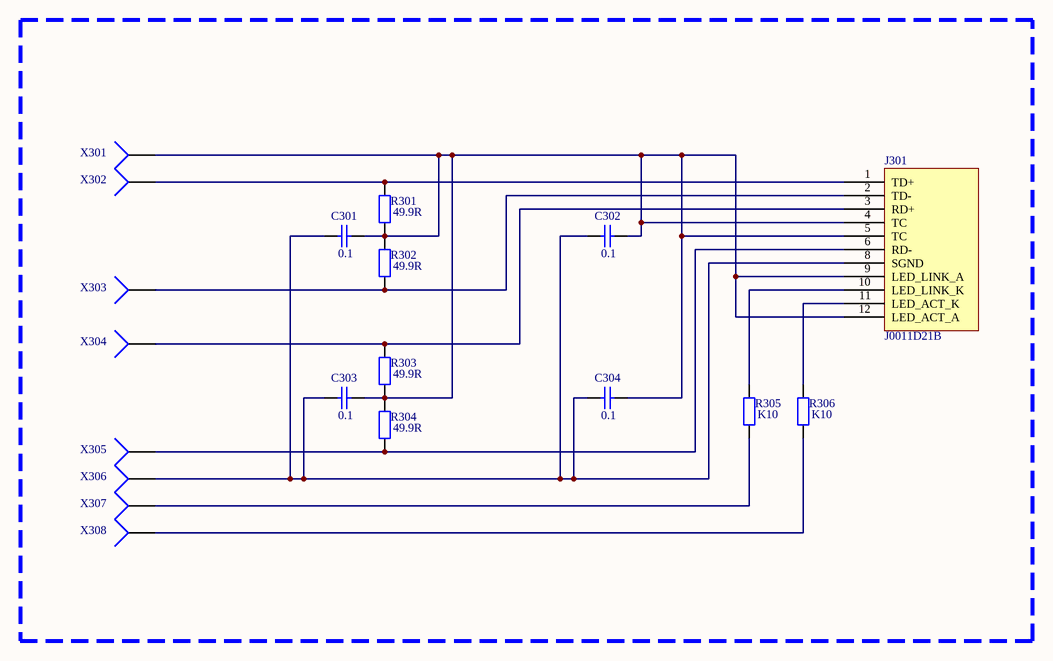
[diagram p3: lan_board.SchDoc]

### Parts
C301  0.1  [C3216-1206]
C302  0.1  [C3216-1206]
C303  0.1  [C3216-1206]
C304  0.1  [C3216-1206]
J301  J0011D21B  [J0011D21B]
R301  49.9R  [_1206]
R302  49.9R  [_1206]
R303  49.9R  [_1206]
R304  49.9R  [_1206]
R305  K10  [_1206]
R306  K10  [_1206]
X301  (no value)  [PIN1]
X302  (no value)  [PIN1]
X303  (no value)  [PIN1]
X304  (no value)  [PIN1]
X305  (no value)  [PIN1]
X306  (no value)  [PIN1]
X307  (no value)  [PIN1]
X308  (no value)  [PIN1]

### Nets
NetC301_1: C301.1 C302.1 C303.1 C304.1 J301.8(SGND) X306.1
NetC301_2: C301.2 C302.2 C303.2 C304.2 J301.4(TC) J301.5(TC) J301.9(LED_LINK_A) J301.12(LED_ACT_A) R301.2 R302.1 R303.2 R304.1 X301.1
NetJ301_1: J301.1(TD+) R301.1 X302.1
NetJ301_2: J301.2(TD-) R302.2 X303.1
NetJ301_3: J301.3(RD+) R303.1 X304.1
NetJ301_6: J301.6(RD-) R304.2 X305.1
NetJ301_10: J301.10(LED_LINK_K) R305.1
NetJ301_11: J301.11(LED_ACT_K) R306.1
NetR305_2: R305.2 X307.1
NetR306_2: R306.2 X308.1

### Library data of the parts
C301-C304 = Cap Semi: as C1 on sheet cpu_board; Published: 8-Jun-2000; Revision: July-2002: Re-released for DXP Platform.; Publisher: Altium Limited; Class II: Capacitor
R301-R306 = Res2: Resistor; Manufacturer: Generic Components; Class I: Passive; Value: 30; Rule: Undefined; Published: 8-Jun-2000; Revision: July-2002: Re-released for DXP Platform.; Publisher: Altium Limited; Class II: Resistor
X301-X308 = Socket: as X22 on sheet cpu_board; Revision: July-2002: Re-released for DXP Platform.; Publisher: Altium Limited

## Sheet eth_part.SchDoc
size A3
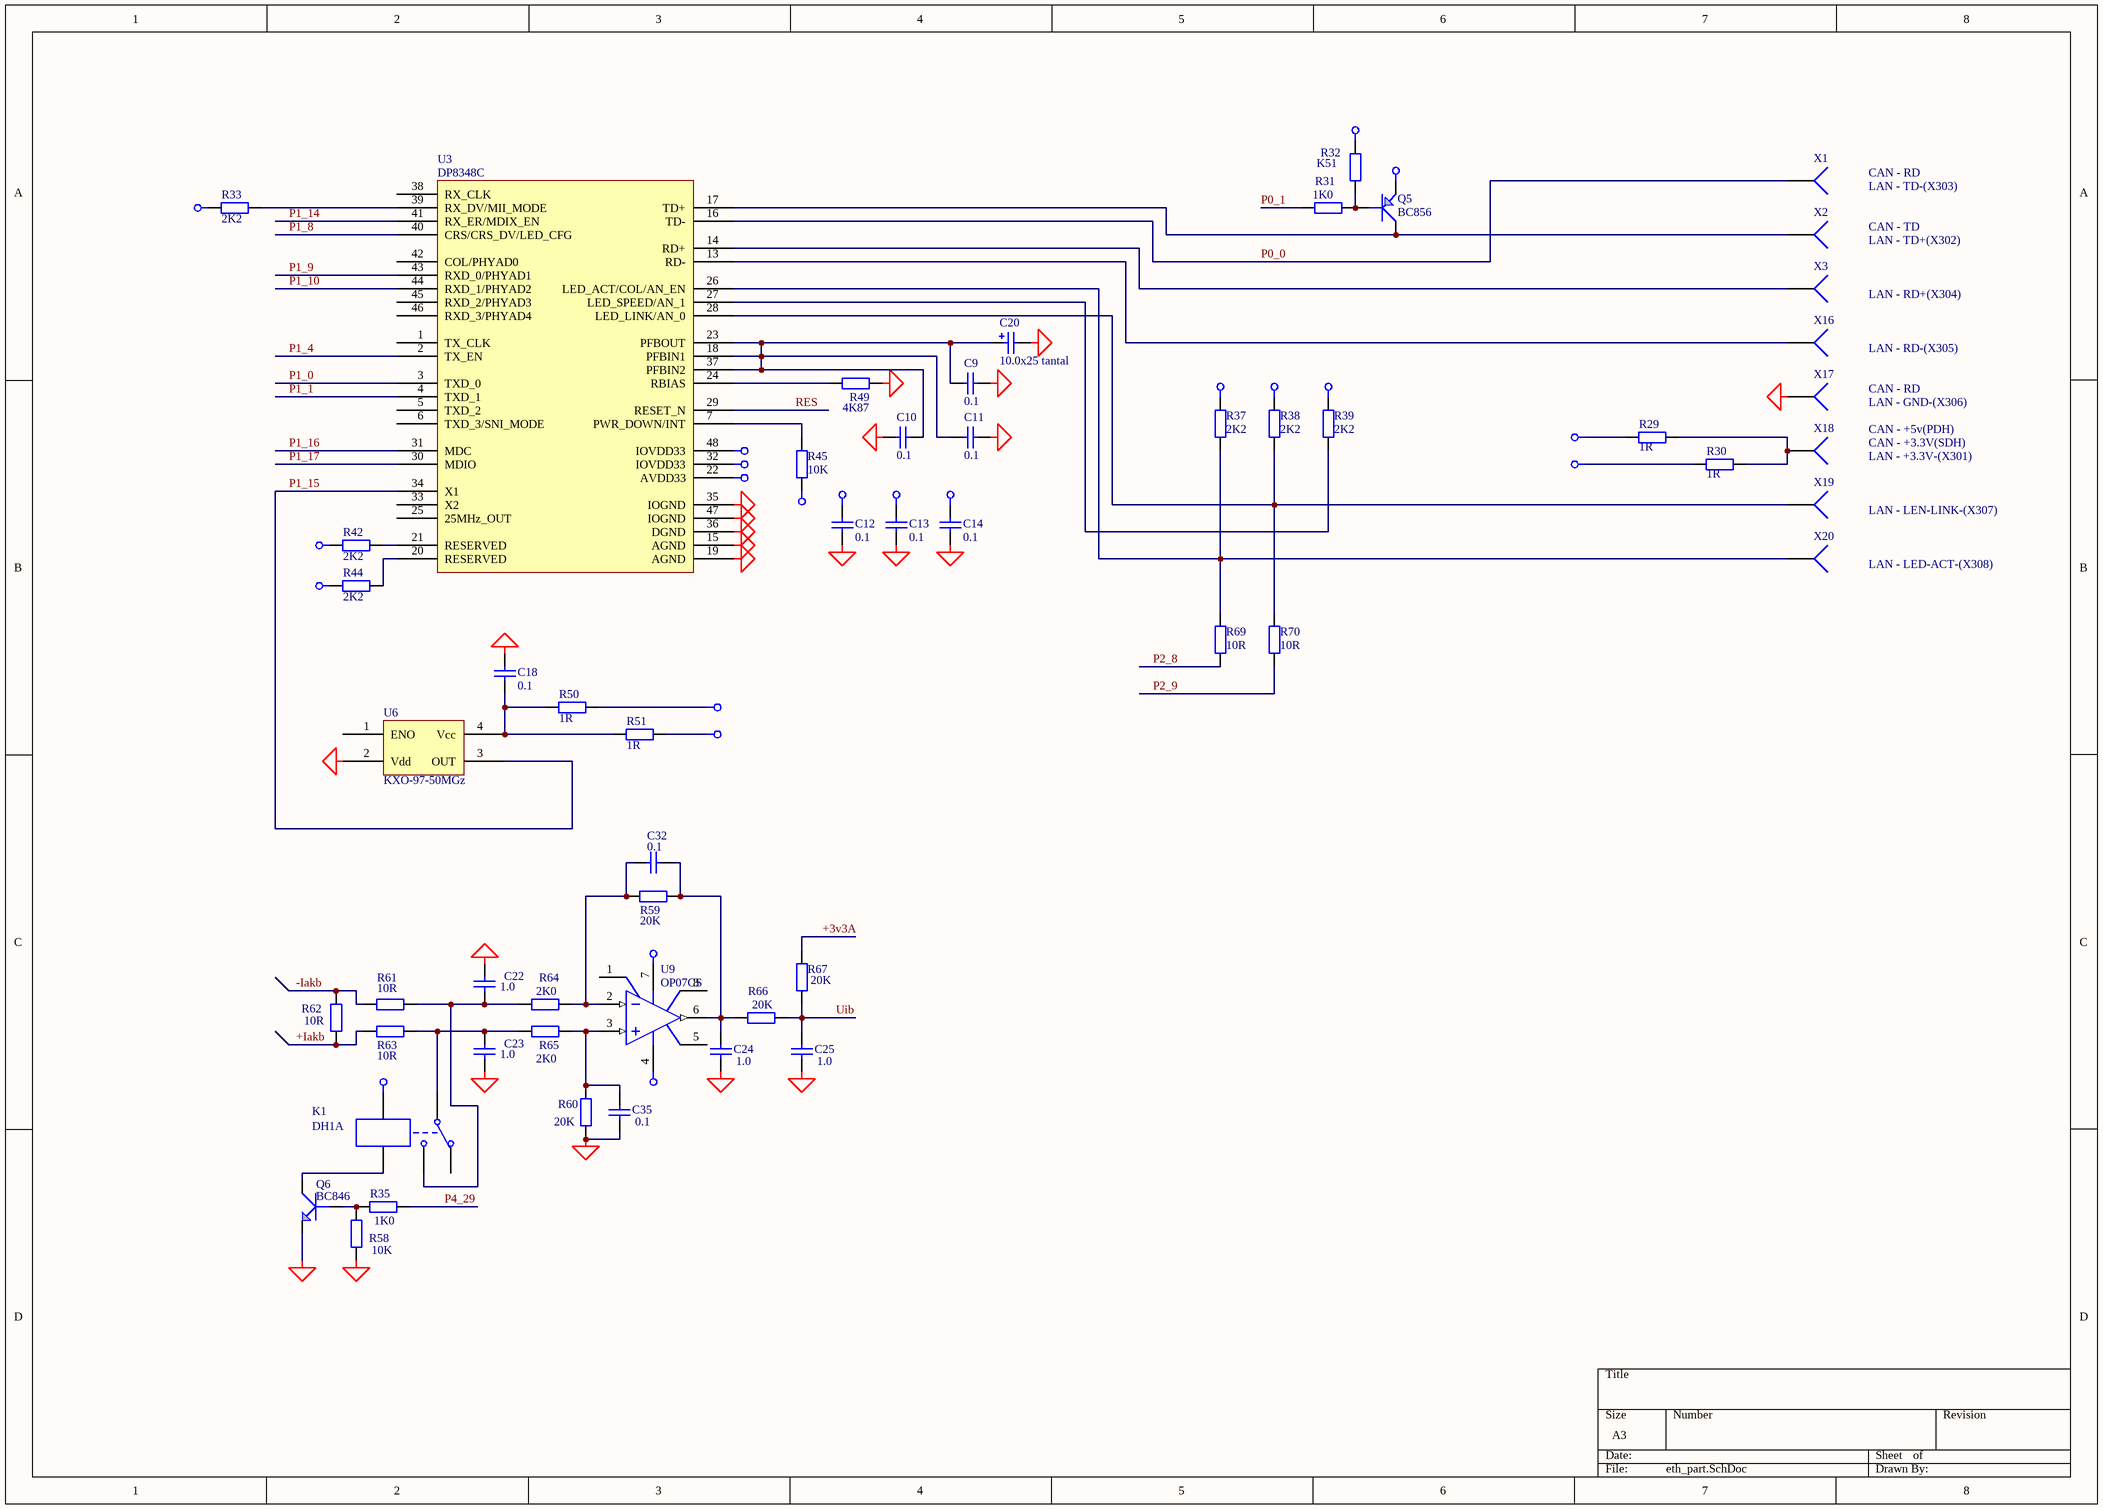
[diagram p4: eth_part.SchDoc]

### Parts
C9  0.1  [C3216-1206]
C10  0.1  [C3216-1206]
C11  0.1  [C3216-1206]
C12  0.1  [_1206]
C13  0.1  [_1206]
C14  0.1  [_1206]
C18  0.1  [_1206]
C20  10.0x25 tantal  [CAP_EL_6_3]
C22  1.0  [_1206]
C23  1.0  [_1206]
C24  1.0  [_1206]
C25  1.0  [_1206]
C32  0.1  [_1206]
C35  0.1  [_1206]
K1  DH1A  [kuan]
Q5  BC856  [SO-G3]
Q6  BC846  [SO-G3]
R29  1R  [_1206]
R30  1R  [_1206]
R31  1K0  [_1206]
R32  K51  [_1206]
R33  2K2  [_1206]
R35  1K0  [_1206]
R37  2K2  [_1206]
R38  2K2  [_1206]
R39  2K2  [_1206]
R42  2K2  [_1206]
R44  2K2  [_1206]
R45  10K  [_1206]
R49  4K87  [_1206]
R50  1R  [_1206]
R51  1R  [_1206]
R58  10K  [_1206]
R59  20K  [_1206]
R60  20K  [_1206]
R61  10R  [_1206]
R62  10R  [_1206]
R63  10R  [_1206]
R64  2K0  [_1206]
R65  2K0  [_1206]
R66  20K  [_1206]
R67  20K  [_1206]
R69  10R  [_1206]
R70  10R  [_1206]
U3  DP8348C  [F-QFP7X7-G48/N]
U6  KXO-97-50MGz  [KXO-97]
U9  OP07CS  [SO-G8]
X1  (no value)  [PIN1]
X2  (no value)  [PIN1]
X3  (no value)  [PIN1]
X16  (no value)  [PIN1]
X17  (no value)  [PIN1]
X18  (no value)  [PIN1]
X19  (no value)  [PIN1]
X20  (no value)  [PIN1]

### Nets
+3v3: C12.1 C13.1 C14.1 Q5.2(E) R29.2 R32.2 R33.2 R37.2 R38.2 R39.2 R42.2 R44.2 R45.2 R51.2 U3.22(AVDD33) U3.32(IOVDD33) U3.48(IOVDD33)
+3v3A: R67.2
+5v: K1.4 R30.2 R50.2 U9.7(V+)
-5v: U9.4(V-)
GND: C9.2 C10.2 C11.2 C12.2 C13.2 C14.2 C18.2 C20.2 C22.1 C23.2 C24.1 C25.1 C35.2 Q6.2(E) R49.1 R58.1 R60.1 U3.15(AGND) U3.19(AGND) U3.35(IOGND) U3.36(DGND) U3.47(IOGND) U6.2(Vdd) X17.1
+Iakb: R62.1 R63.2
-Iakb: R61.2 R62.2
P0_0: U3.16(TD-) X1.1
P0_1: R31.2
P1_0: U3.3(TXD_0)
P1_1: U3.4(TXD_1)
P1_4: U3.2(TX_EN)
P1_8: U3.40(CRS/CRS_DV/LED_CFG)
P1_9: U3.43(RXD_0/PHYAD1)
P1_10: U3.44(RXD_1/PHYAD2)
P1_14: U3.41(RX_ER/MDIX_EN)
P1_15: U3.34(X1) U6.3(OUT)
P1_16: U3.31(MDC)
P1_17: U3.30(MDIO)
P2_8: R69.1
P2_9: R70.1
P4_29: R35.1
RES: U3.29(RESET_N)
Uib: C25.2 R66.2 R67.1
NetC9_1: C9.1 C10.1 C11.1 C20.1 U3.18(PFBIN1) U3.23(PFBOUT) U3.37(PFBIN2)
NetC18_1: C18.1 R50.1 R51.1 U6.4(Vcc)
NetC22_2: C22.2 K1.3 R61.1 R64.1
NetC23_1: C23.1 K1.1 R63.1 R65.1
NetC24_2: C24.2 C32.2 R59.1 R66.1 U9.6(OUT)
NetC32_1: C32.1 R59.2 R64.2 U9.2(IN-)
NetC35_1: C35.1 R60.2 R65.2 U9.3(IN+)
NetK1_5: K1.5 Q6.3(C)
NetQ5_1: Q5.1(B) R31.1 R32.1
NetQ5_3: Q5.3(C) U3.17(TD+) X2.1
NetQ6_1: Q6.1(B) R35.2 R58.2
NetR29_1: R29.1 R30.1 X18.1
NetR33_1: R33.1 U3.39(RX_DV/MII_MODE)
NetR37_1: R37.1 R69.2 U3.26(LED_ACT/COL/AN_EN) X20.1
NetR38_1: R38.1 R70.2 U3.28(LED_LINK/AN_0) X19.1
NetR39_1: R39.1 U3.27(LED_SPEED/AN_1)
NetR42_1: R42.1 U3.21(RESERVED)
NetR44_1: R44.1 U3.20(RESERVED)
NetR45_1: R45.1 U3.7(PWR_DOWN/INT)
NetR49_2: R49.2 U3.24(RBIAS)
NetU3_13: U3.13(RD-) X16.1
NetU3_14: U3.14(RD+) X3.1

Not connected (* = marked no-connect by the designer): K1 2; U3 1(TX_CLK) 5(TXD_2) 6(TXD_3/SNI_MODE) 25(25MHz_OUT) 33(X2) 38(RX_CLK) 42(COL/PHYAD0) 45(RXD_2/PHYAD3) 46(RXD_3/PHYAD4); U6 1(ENO); U9 1(VOSTRIM) 5(NC) 8(VOSTRIM)

### Notes on the sheet
- CAN - RD
- CAN - TD
- LAN - TD+(X302)
- LAN - TD-(X303)
- LAN - RD+(X304)
- LAN - RD-(X305)
- LAN - GND-(X306)
- CAN - +3.3V(SDH)
- CAN - +5v(PDH)
- LAN - LEN-LINK-(X307)
- LAN - +3.3V-(X301)
- LAN - LED-ACT-(X308)

### Library data of the parts
C9-C14 C18 C22-C25 = Cap Semi: as C1 on sheet cpu_board; Published: 8-Jun-2000; Revision: July-2002: Re-released for DXP Platform.; Publisher: Altium Limited; Class II: Capacitor
C20 = Cap Pol1: as C700 on sheet power_board; Published: 8-Jun-2000; Revision: July-2002: Re-released for DXP Platform.; Publisher: Altium Limited; Class II: Capacitor
C32 C35 = Cap Semi: as C15 on sheet cpu_board; Published: 8-Jun-2000; Revision: July-2002: Re-released for DXP Platform.; Publisher: Altium Limited; Class II: Capacitor
K1 = BS115: Single-Pole Dual-Throw Relay; Manufacturer: Generic Components; Class I: Electro-mechanical; Published: 24-Mar-1999; Revision: July-2002: Re-released for DXP Platform.; Publisher: Altium Limited; Class II: Relay
Q5 = GT109: Right: 20; Bottom: 20
Q6 = GT122: Right: 20; Bottom: 20
R29 R30 R33 R37-R39 R42 R44 R49-R51 R69 R70 = Res2: Resistor; Manufacturer: Generic Components; Class I: Passive; Value: 10K; Rule: Undefined; Published: 8-Jun-2000; Revision: July-2002: Re-released for DXP Platform.; Publisher: Altium Limited; Class II: Resistor
R31 = Res2: as R12 on sheet cpu_board; Published: 8-Jun-2000; Revision: July-2002: Re-released for DXP Platform.; Publisher: Altium Limited; Class II: Resistor
R32 R35 R45 R61-R63 = Res2: as R1 on sheet cpu_board; Published: 8-Jun-2000; Revision: July-2002: Re-released for DXP Platform.; Publisher: Altium Limited; Class II: Resistor
  R32: Value: K51
  R35: Value: 1K0
  R45: Value: 10K
  R61-R63: Value: 10R
R58-R60 R64-R67 = Res2: as R36 on sheet cpu_board; Published: 8-Jun-2000; Revision: July-2002: Re-released for DXP Platform.; Publisher: Altium Limited; Class II: Resistor
  R58: Value: 10K
  R59 R60 R66 R67: Value: 20K
  R64 R65: Value: 2K0
U6 = KXO-97
U9 = OP07CS: Ultra-Low Offset Voltage Operational Amplifier; Manufacturer: Analog Devices; Note: Pin 5 is not connected.; Published: 8-Jun-2000; Revision: July-2002: Re-released for DXP Platform.; Datasheet: Designer's Reference Manual CD (1992); Package Reference: SO-8B; Publisher: Altium Limited; Class I: Amplifier; Class II: Operational Amplifier
X1-X3 X16-X20 = Socket: as X22 on sheet cpu_board; Revision: July-2002: Re-released for DXP Platform.; Publisher: Altium Limited

## Nets that join several sheets
+3v3: cpu_board (13 pins), rs232_part (U15.1), eth_part (17 pins)
+3v3A: cpu_board (5 pins), eth_part (R67.2)
+5v: cpu_board (12 pins), rs232_part (R68.2 R72.2 R73.1 U5.8), eth_part (K1.4 R30.2 R50.2 U9.7)
+5v_iz: cpu_board (JP6.10), rs232_part (5 pins)
-5v: cpu_board (C16.2 JP6.8 Q4.3 R90.1), eth_part (U9.4)
-5v_iz: cpu_board (JP6.9), rs232_part (8 pins)
GND: cpu_board (58 pins), rs232_part (U5.4 U8.7 U16.5 U16.7), eth_part (24 pins)
+Iakb: cpu_board (JP1.6), eth_part (R62.1 R63.2)
-Iakb: cpu_board (JP1.2), eth_part (R61.2 R62.2)
P0_0: cpu_board (U1.46), eth_part (U3.16 X1.1)
P0_1: cpu_board (U1.47), eth_part (R31.2)
P0_15: cpu_board (U1.62), rs232_part (U5.6)
P0_17: cpu_board (U1.61), rs232_part (U5.2)
P0_18: cpu_board (U1.60), rs232_part (U5.5)
P0_27: cpu_board (U1.25), rs232_part (R68.1 U5.1)
P1_0: cpu_board (U1.95), eth_part (U3.3)
P1_1: cpu_board (U1.94), eth_part (U3.4)
P1_4: cpu_board (U1.93), eth_part (U3.2)
P1_8: cpu_board (U1.92), eth_part (U3.40)
P1_9: cpu_board (U1.91), eth_part (U3.43)
P1_10: cpu_board (U1.90), eth_part (U3.44)
P1_14: cpu_board (U1.89), eth_part (U3.41)
P1_15: cpu_board (U1.88), eth_part (U3.34 U6.3)
P1_16: cpu_board (U1.87), eth_part (U3.31)
P1_17: cpu_board (U1.86), eth_part (U3.30)
P2_8: cpu_board (U1.65), eth_part (R69.1)
P2_9: cpu_board (U1.64), eth_part (R70.1)
P4_29: cpu_board (U1.85), eth_part (R35.1)
prog_reset: cpu_board (X37.1), rs232_part (U8.8)
prog_set: cpu_board (X29.1), rs232_part (U16.8)
RES: cpu_board (U1.17 X34.1), eth_part (U3.29)
RX0: cpu_board (X25.1), rs232_part (U16.6)
TX0: cpu_board (X45.1), rs232_part (R43.1)
Uib: cpu_board (U4.1), eth_part (C25.2 R66.2 R67.1)